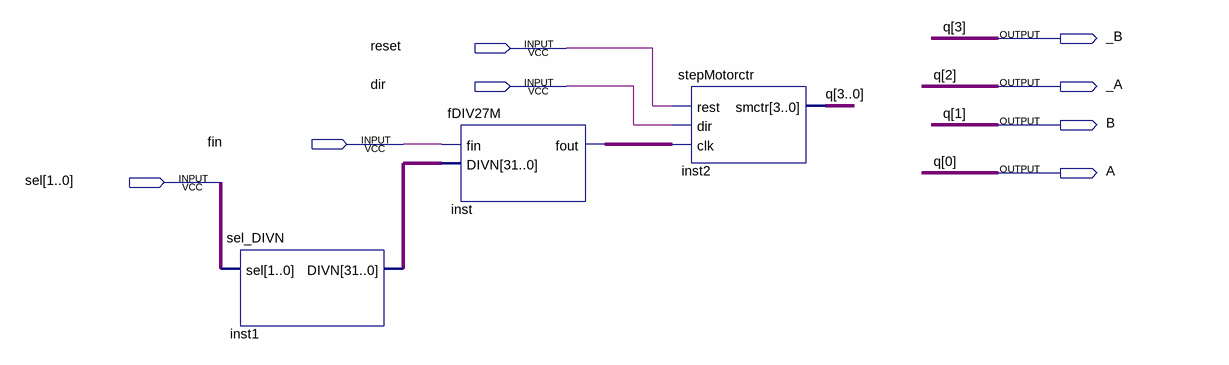
[diagram p0: schematic sheet]
// Quartus schematic hw2.bdf as structural Verilog: 3 symbols, 8 pins
module hw2 (
  input  reset,
  input  dir,
  input  fin,
  input  [1:0] sel,
  output _B,
  output _A,
  output B,
  output A
);

  wire inst_fout;
  wire [31:0] inst1_divn;

  sel_DIVN inst1 (.sel(sel), .DIVN(inst1_divn));
  fDIV27M inst (.fin(fin), .DIVN(inst1_divn), .fout(inst_fout));
  stepMotorctr inst2 (.rest(reset), .dir(dir), .clk(inst_fout), .smctr({_B, _A, B, A}));

  // Other names for the same wires on the sheet: q[3:0] = {_B, _A, B, A}
endmodule
